# EAGLE design BIRDS-5_FM_-Y Panel_Ver2 (EAGLE 9.6.2)
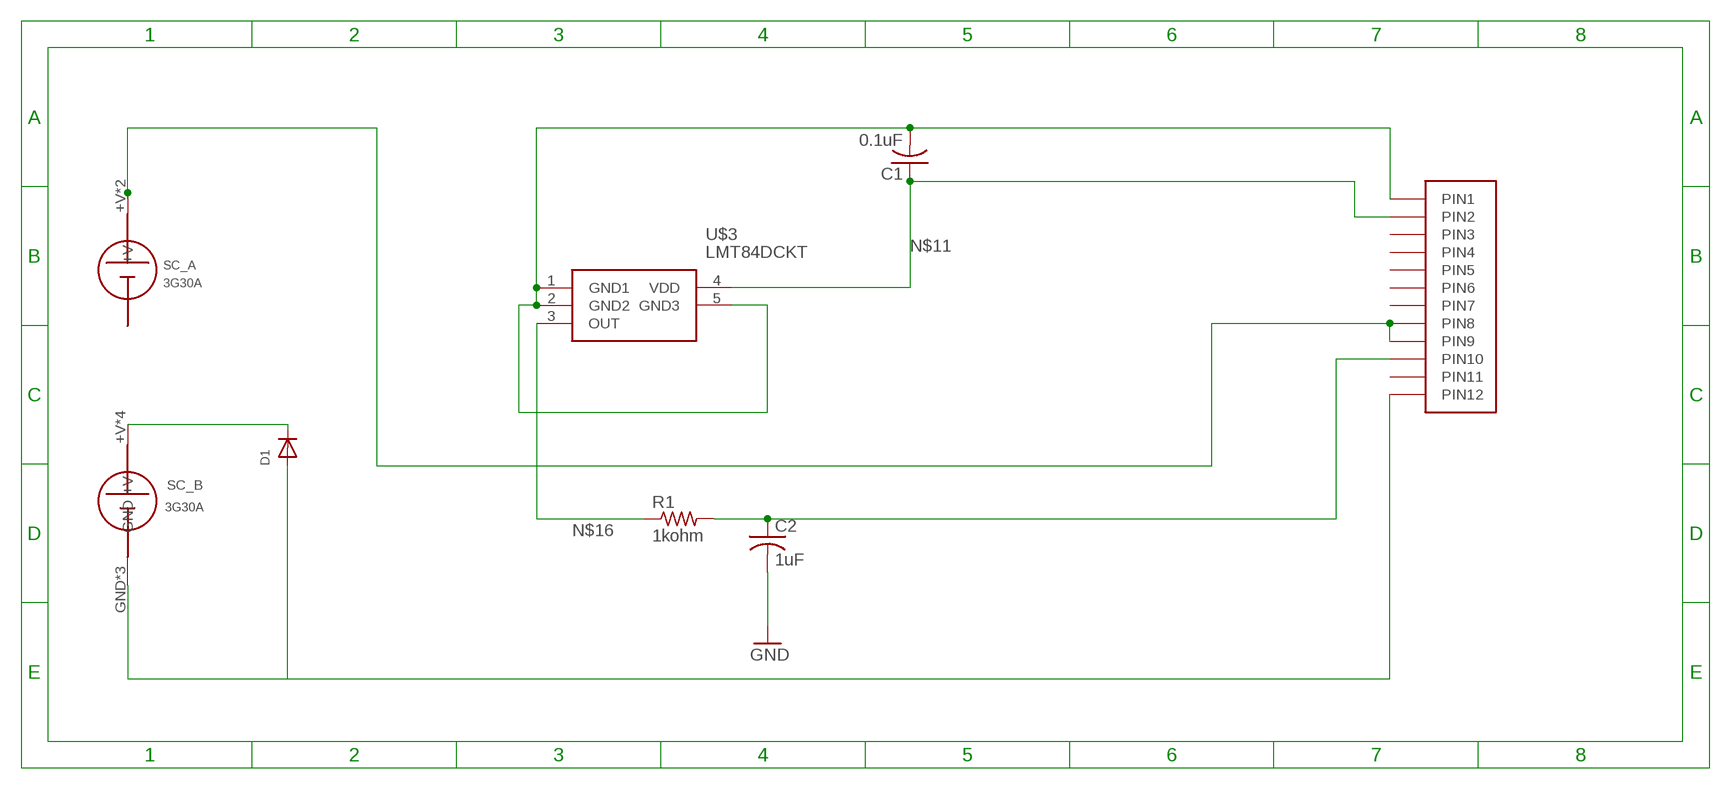
[diagram p0: schematic, sheet 1]

## Parts
C1  0.1uF  C-USC0805  [C0805]
C2  1uF  C-USC0805  [C0805]
D1  DIODE_SOD-123FL  [SOD-123FL]
R1  1kohm  R-US_R0402  [R0402]
SOLARCELL_A  SC_A_SC_A  [SC_A_SC_A]
U$1  HEADER12PIN  [HEADER12PIN]
U$2  SC_B-2_SC_B  [SC_B-2_SC_B]
U$3  LMT84DCKT  [SOT65P210X110-5N]

## Nets
+V: SOLARCELL_A.+V SOLARCELL_A.+V1(+V) U$1.P8(PIN8) U$1.P9(PIN9)
+VB: D1.C U$2.+V U$2.+V2(+V) U$2.+V3(+V) U$2.+V4(+V)
GND: C1.2 C2.2 D1.A U$1.P1(PIN1) U$1.P12(PIN12) U$2.GND U$2.GND1(GND) U$2.GND2(GND) U$3.1(GND1) U$3.2(GND2) U$3.5(GND3)
N$11: C1.1 U$1.P2(PIN2) U$3.4(VDD)
N$16: R1.1 U$3.3(OUT)
N$19: C2.1 R1.2 U$1.P10(PIN10)
Unconnected: U$1.P3(PIN3) U$1.P4(PIN4) U$1.P5(PIN5) U$1.P6(PIN6) U$1.P7(PIN7) U$1.P11(PIN11)

## Library data of the parts
C1 C2 = adafruit:C-US: CAPACITOR, American symbol
D1 = adafruit:DIODE: Diode SMADIODE - SMA Surface Mount Package 20V 1A Schottky Diode Digikey: 641-1014-6-ND DO-1N4148 - Through Hole Small Current Diode SOD-123 20V 1 A (.5mV Vf) Schottky Diode - Digikey: MBRX120TPMSCT-ND SOD-323 10V 570mA (.38mV Vf, 3ns) Schottky Diode - Digikey: ZLLS410CT-ND SOD-523 30V 30mA Schottky Diode (RB751S-40TE61) - Digikey: RB751S-40TE61CT-ND SOT23-R/W - SOT23 Package (R = Solder Paste/Reflow Ovens, W = Hand-Soldering) BAT54Film 40V 300mA - Digikey: 497-7162-1-ND
R1 = adafruit:R-US_: RESISTOR, American symbol
SOLARCELL_A = B5_EM_-Y_Panel:SC_A_SC_A
U$1 = BIRDS:HEADER12PIN
U$2 = B5_EM_-Y_Panel:SC_B-2_SC_B
U$3 = LMT84DCKT:LMT84DCKT: 1.5V-Capable, 10 uA Analog Output Temperature Sensor in SC70 and TO-92 Source: Datasheet <http://uk.rs-online.com/web/p/products/8115860>; DESCRIPTION: 1.5V-Capable, 10 uA Analog Output Temperature Sensor in SC70 and TO-92; HEIGHT: 1.1mm; MANUFACTURER_NAME: Texas Instruments; MANUFACTURER_PART_NUMBER: LMT84DCKT; RS_PART_NUMBER: 8115860

## Board
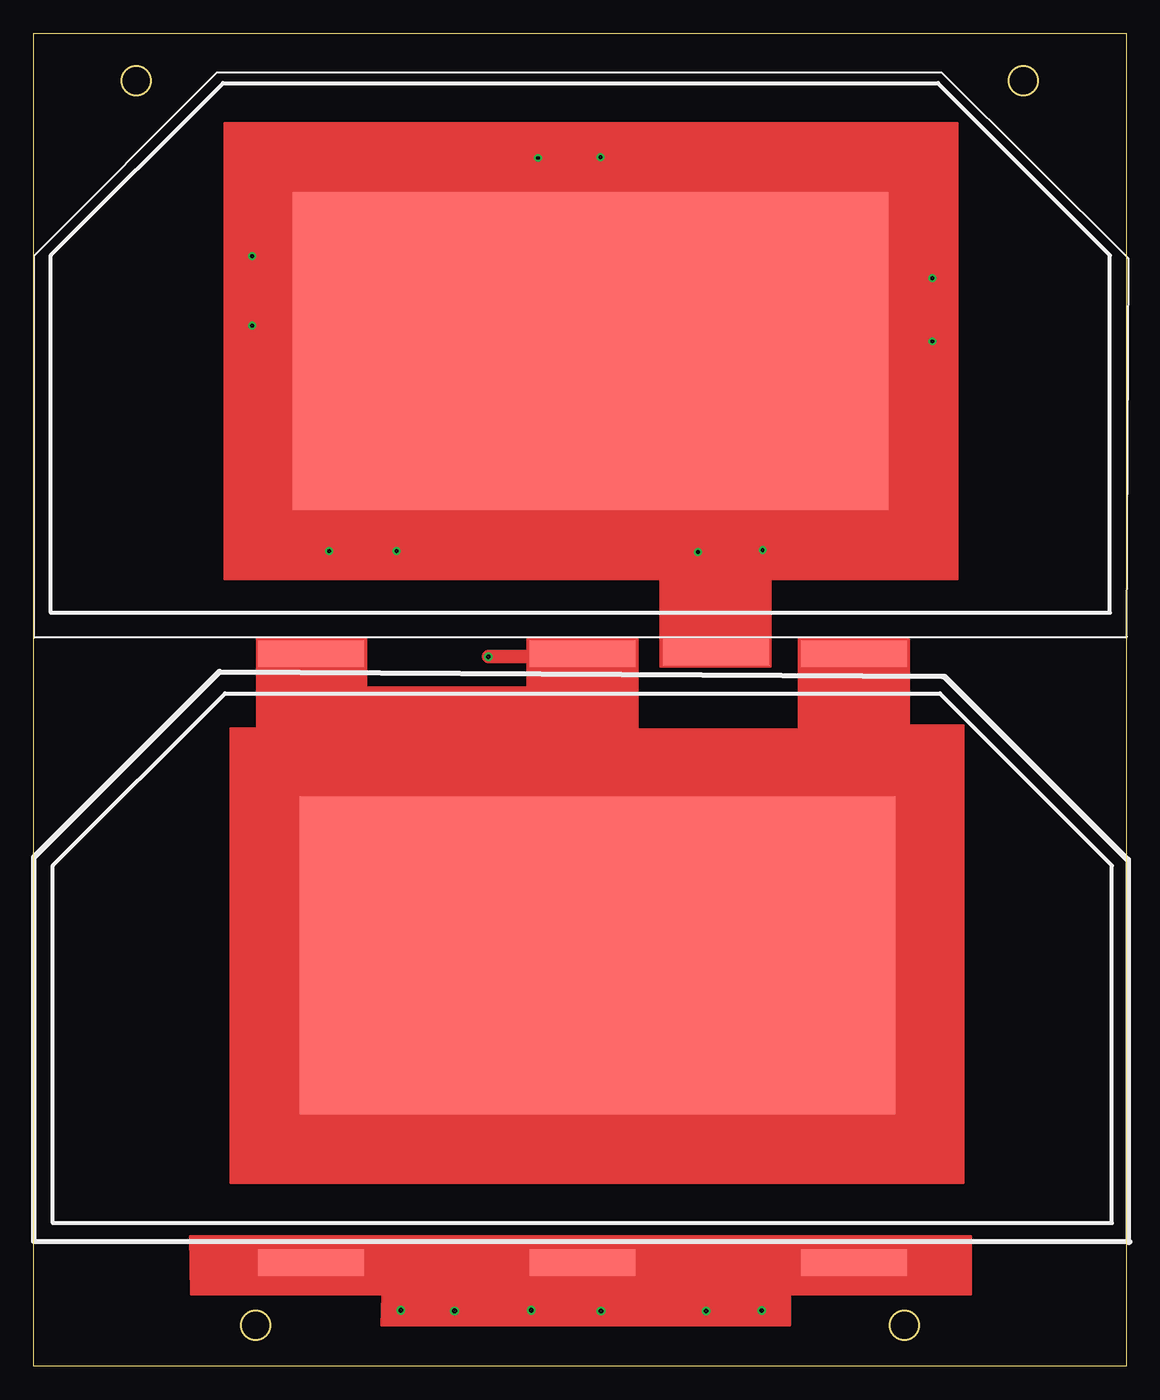
[diagram p1: board, top side]
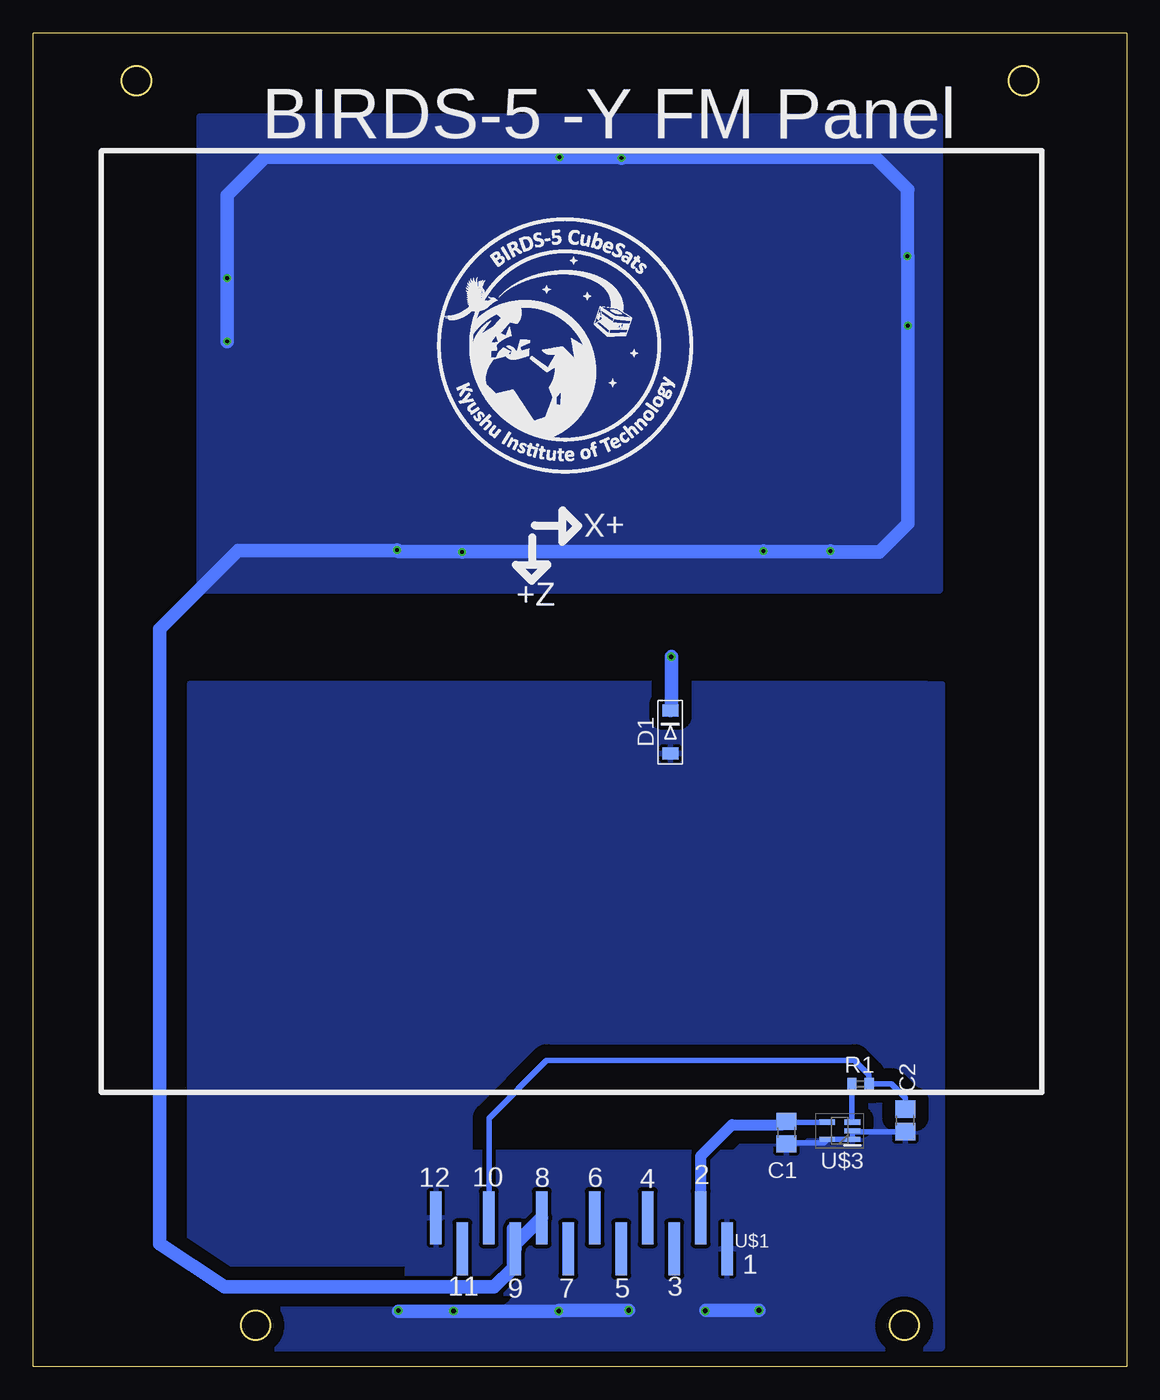
[diagram p2: board, bottom side, seen from below]

Size 82.6 x 100.7 mm. Coordinates in mm from the lower left corner, seen from the top.
Outline: 82.6,0 82.6,100.7 0,100.7 0,0 82.6,0
Outline: circle at 74.8,97.1 radius 1.1
Outline: circle at 65.8,3.1 radius 1.1
Outline: circle at 16.8,3.1 radius 1.1
Outline: circle at 7.79,97.09 radius 1.1
Copper layers (1*16): Top 0.035mm / dielectric 1.53mm / Bottom 0.035mm
Design rules "pban_5mil-l2": minimum track width 5mil, minimum drill 0.3mm, track to track 5mil, track to pad 0.229mm, pad to pad 5mil, via to via 5mil, smd to smd 5mil, copper to edge 0.5mm, drill to drill 0.5mm, minimum pad ring 0.15mm, minimum via ring 0.15mm, stop-mask expansion 4mil, vias tented up to drill 0.35mm, thermal gap 10mil

### Footprints (pad centres in the part's own frame; a part is rotated, then mirrored left to right if it is on the bottom)
C0805 = smd 1.3 x 1.5: 1 -0.85,0; 2 0.85,0
SOD-123FL = smd 0.91 x 1.22 bottom: A 1.637,0; C -1.637,0
R0402 = smd 0.7 x 0.9: 1 -0.65,0; 2 0.65,0
SC_A_SC_A = smd 45 x 24: +V 40.75,19.75 | smd 8 x 2: +V1 50.25,-3
HEADER12PIN = smd 4 x 0.89: P1 0,0; P2 2.35,2; P3 0,4; P4 2.35,6; P5 0,8; P6 2.35,10; P7 0,12; P8 2.35,14; P9 0,16; P10 2.35,18; P11 0,20; P12 2.35,22
SC_B-2_SC_B = smd 45 x 24: +V 41.14,20.22 | smd 8 x 2: +V2 19.5,43; +V3 40,43; +V4 60.5,43; GND 60.5,-3; GND1 19.5,-3; GND2 40,-3
SOT65P210X110-5N = smd 1.2 x 0.4: 1 -0.95,0.65; 2 -0.95,0; 3 -0.95,-0.65; 4 0.95,-0.65; 5 0.95,0.65

### Placement (x,y rotation side)
C1  25.7,17.67 270 bottom
C2  16.72,18.58 270 bottom
D1  34.46,47.91 270 top
R1  20.11,21.33 0 bottom
SOLARCELL_A  1.34,56.93 0 top
U$1  30.18,8.88 90 bottom
U$2  1.49,10.83 0 top
U$3  21.67,17.8 180 bottom

### Tracks (layer width: path | path; a pad name or v marks a point on that pad's centre or on a via)
+V  (via drill 0.3)
  Top 0.152: 50.21,56.72 SOLARCELL_A.+V1
  Top 1.016: v42.84,91.32 42.84,78.71 SOLARCELL_A.+V | v50.21,61.51 50.21,56.72
  Bottom 0.152: v50.21,61.51 50.23,61.53 | 16.54,78.61 v16.53,78.62 | 16.55,88.87 16.54,88.88 | v16.55,83.87 16.53,83.85
  Bottom 1.016: U$1.P8 46.17,9.24 46.2,9.23 U$1.P9 46.31,10.39 46.31,7.45 47.77,5.99 68.13,5.99 73.05,9.27 73.05,55.7 67.11,61.63 v55.12,61.63 v55.11,61.64 54.99,61.53 50.23,61.53 | v50.21,61.51 50.17,61.55 27.47,61.55 v27.44,61.58 27.39,61.53 22.43,61.53 v22.37,61.59 22.28,61.51 18.68,61.51 16.54,63.65 16.54,78.61 | 16.54,88.88 18.99,91.32 38.09,91.32 v38.14,91.27 38.18,91.31 v42.83,91.31 v42.84,91.32 65.07,91.32 67.93,88.47 v67.93,82.2 v67.93,77.42 | 16.55,88.87 v16.55,83.87 | 16.53,83.85 v16.53,78.62
  pour Bottom (isolate 0.305): 14.18,94.35 14.18,58.64 69.95,58.64 69.95,94.35
+VB  (via drill 0.35)
  Top 0.152: 34.41,53.62 v34.39,53.6 34.66,53.6 | U$2.+V 43.61,32.02 | 34.66,53.6 | 37.5,53.6 34.66,53.6
  Top 1.016: 34.41,53.62 41.28,53.62 U$2.+V3 41.49,36.83 37.24,32.57 38.76,31.05 U$2.+V | U$2.+V4 61.99,39.06 54.95,32.02 43.61,32.02 | 37.5,53.6 37.92,54.02 38.6,54.02 40.12,52.5 41.88,52.5 44.65,49.73 23.53,49.73 20.99,52.27 U$2.+V2
  Bottom 1.016: v34.39,53.6 34.39,49.62 D1.C
GND  (via drill 0.35)
  Top 0.152: 42.95,4.12 v42.9,4.18 | 37.59,4.21 v37.62,4.24
  Top 1.016: U$2.GND1 25.02,7.83 27.78,5.07 v27.78,4.24 | 42.95,4.12 42.95,6.38 U$2.GND2 U$2.GND | 37.59,4.21 31.84,4.21 v31.83,4.2
  Bottom 0.152: 20.65,17.73 U$3.2 | 31.79,4.24 v31.83,4.2 | v55.03,4.21 55,4.18 | 50.85,4.18 v50.84,4.19 50.83,4.18
  Bottom 0.406: U$3.2 U$3.1 U$3.5 22.88,16.89 25.63,16.89 C1.2 | C2.2 20.65,17.73
  Bottom 1.016: v27.78,4.24 31.79,4.24 | v37.62,4.24 42.84,4.24 v42.9,4.18 50.83,4.18 | 55,4.18 50.85,4.18
  pour Bottom (isolate 0.305): 27.91,6.9 29.38,5.43 54.35,5.43 54.35,16.26 27.99,16.26 27.91,16.18
  pour Bottom (isolate 1): 15.14,51.57 70.75,51.57 70.77,51.55 70.77,1.34 70.75,1.32 14.04,1.32 13.91,1.45 13.91,51.52 13.94,51.55 15.23,51.55
N$11
  Bottom 0.152: 25.63,18.45 C1.1
  Bottom 0.406: U$3.4 25.63,18.45
  Bottom 0.813: C1.1 25.97,18.25 29.81,18.25 32.19,15.87 32.18,15.85 U$1.P2
N$16
  Bottom 0.152: 20.76,18.49 U$3.3
  Bottom 0.406: R1.1 20.76,18.49
N$19
  Bottom 0.406: U$1.P10 48.18,18.75 43.82,23.12 20.55,23.12 19.46,22.03 R1.2 17.76,21.33 16.72,20.29 C2.1

### Text on the board
bPlace: BIRDS-5 -Y FM Panel | +X | +Z
bNames: 2 | 6 | 8 | 10 | 12 | 4 | U$1 | 1 | 3 | 5 | 7 | 9 | 11